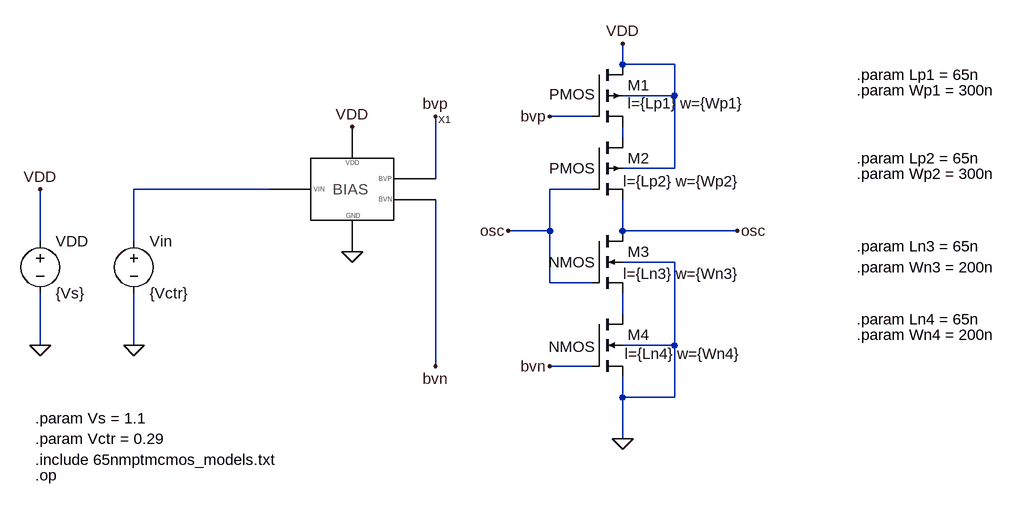
[diagram p0: schematic Est.asc]
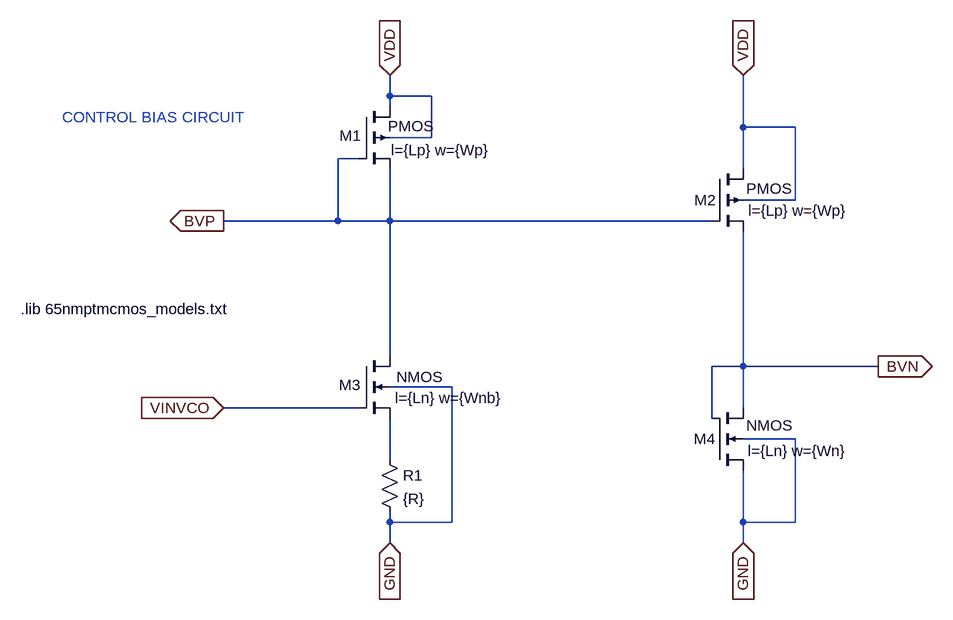
[diagram p1: sub-circuit bias.asc]
Est.asc, the LTspice schematic file:
Version 4
SHEET 1 1880 680
WIRE 816 -112 816 -144
WIRE 896 -112 816 -112
WIRE 896 -64 896 -112
WIRE 896 -64 816 -64
WIRE 768 -32 704 -32
WIRE 816 0 816 -16
WIRE 896 48 896 -64
WIRE 896 48 816 48
WIRE 528 64 528 -32
WIRE 272 80 64 80
WIRE 768 80 704 80
WIRE 704 144 704 80
WIRE 704 144 640 144
WIRE 816 144 816 96
WIRE 992 144 816 144
WIRE -80 160 -80 80
WIRE 64 160 64 80
WIRE 896 192 816 192
WIRE 704 224 704 144
WIRE 768 224 704 224
WIRE 816 272 816 240
WIRE -80 320 -80 240
WIRE 64 320 64 240
WIRE 896 320 896 192
WIRE 896 320 816 320
WIRE 528 352 528 96
WIRE 768 352 704 352
WIRE 816 400 816 368
WIRE 896 400 896 320
WIRE 896 400 816 400
WIRE 816 464 816 400
FLAG -80 320 0
FLAG 64 320 0
FLAG 816 464 0
FLAG 400 176 0
FLAG -80 80 VDD
FLAG 400 -16 VDD
FLAG 816 -144 VDD
FLAG 640 144 osc
FLAG 528 -32 bvp
FLAG 704 -32 bvp
FLAG 528 352 bvn
FLAG 704 352 bvn
FLAG 992 144 osc
SYMBOL Bias 400 80 R0
SYMATTR InstName X1
SYMBOL pmos4 768 -112 R0
WINDOW 3 -65 46 Left 2
WINDOW 123 56 60 Left 2
SYMATTR Value2 l={Lp1} w={Wp1}
SYMATTR InstName M1
SYMBOL pmos4 768 0 R0
WINDOW 3 -65 48 Left 2
WINDOW 123 49 68 Left 2
SYMATTR Value2 l={Lp2} w={Wp2}
SYMATTR InstName M2
SYMBOL nmos4 768 144 R0
WINDOW 3 -66 48 Left 2
WINDOW 123 49 66 Left 2
SYMATTR Value2 l={Ln3} w={Wn3}
SYMATTR InstName M3
SYMBOL nmos4 768 272 R0
WINDOW 3 -66 50 Left 2
WINDOW 123 51 61 Left 2
SYMATTR Value2 l={Ln4} w={Wn4}
SYMATTR InstName M4
SYMBOL voltage -80 144 R0
SYMATTR InstName VDD
SYMATTR Value {Vs}
SYMBOL voltage 64 144 R0
SYMATTR InstName Vin
SYMATTR Value {Vctr}
TEXT -88 432 Left 2 !.param Vs = 1.1
TEXT -88 464 Left 2 !.param Vctr = 0.29
TEXT -88 496 Left 2 !.include 65nmptmcmos_models.txt
TEXT -88 520 Left 2 !.op
TEXT 1176 -96 Left 2 !.param Lp1 = 65n
TEXT 1176 -72 Left 2 !.param Wp1 = 300n
TEXT 1176 32 Left 2 !.param Lp2 = 65n
TEXT 1176 56 Left 2 !.param Wp2 = 300n
TEXT 1176 168 Left 2 !.param Ln3 = 65n
TEXT 1176 200 Left 2 !.param Wn3 = 200n
TEXT 1176 280 Left 2 !.param Ln4 = 65n
TEXT 1176 304 Left 2 !.param Wn4 = 200n

bias.asc, the sub-circuit schematic file:
Version 4
SHEET 1 1292 832
WIRE 80 32 80 0
WIRE 144 32 80 32
WIRE 80 48 80 32
WIRE 624 80 624 0
WIRE 704 80 624 80
WIRE 144 96 144 32
WIRE 144 96 80 96
WIRE 32 128 0 128
WIRE 624 144 624 80
WIRE 704 192 704 80
WIRE 704 192 624 192
WIRE 0 224 0 128
WIRE 0 224 -176 224
WIRE 80 224 80 144
WIRE 80 224 0 224
WIRE 576 224 80 224
WIRE 80 432 80 224
WIRE 624 448 624 240
WIRE 624 448 576 448
WIRE 832 448 624 448
WIRE 176 480 80 480
WIRE 32 512 -176 512
WIRE 624 512 624 448
WIRE 576 528 576 448
WIRE 704 560 624 560
WIRE 80 592 80 528
WIRE 80 688 80 672
WIRE 176 688 176 480
WIRE 176 688 80 688
WIRE 624 688 624 608
WIRE 704 688 704 560
WIRE 704 688 624 688
WIRE 80 720 80 688
WIRE 624 720 624 688
FLAG 832 448 BVN
IOPIN 832 448 Out
FLAG 80 0 VDD
IOPIN 80 0 In
FLAG 624 0 VDD
IOPIN 624 0 In
FLAG -176 224 BVP
IOPIN -176 224 Out
FLAG 80 720 GND
IOPIN 80 720 In
FLAG 624 720 GND
IOPIN 624 720 In
FLAG -176 512 VINVCO
IOPIN -176 512 In
SYMBOL res 64 576 R0
SYMATTR InstName R1
SYMATTR Value {R}
SYMBOL pmos4 32 48 R0
WINDOW 123 50 67 Left 2
WINDOW 0 -29 45 Left 2
WINDOW 3 45 30 Left 2
SYMATTR Value2 l={Lp} w={Wp}
SYMATTR InstName M1
SYMBOL pmos4 576 144 R0
WINDOW 123 56 64 Left 2
WINDOW 0 -27 48 Left 2
WINDOW 3 53 30 Left 2
SYMATTR Value2 l={Lp} w={Wp}
SYMATTR InstName M2
SYMBOL nmos4 32 432 R0
WINDOW 123 56 65 Left 2
WINDOW 0 -30 45 Left 2
WINDOW 3 58 32 Left 2
SYMATTR Value2 l={Ln} w={Wnb}
SYMATTR InstName M3
SYMBOL nmos4 576 608 M180
WINDOW 123 55 30 Left 2
WINDOW 0 -28 48 Left 2
WINDOW 3 53 69 Left 2
SYMATTR Value2 l={Ln} w={Wn}
SYMATTR InstName M4
TEXT -488 360 Left 2 !.lib 65nmptmcmos_models.txt
TEXT -424 64 Left 2 ;CONTROL BIAS CIRCUIT

The netlist it stands for:
* Est.asc
XX1 VDD 0 bvp bvn N002 bias
M1 VDD bvp N001 VDD PMOS l={Lp1} w={Wp1}
M2 N001 osc osc VDD PMOS l={Lp2} w={Wp2}
M3 osc osc N003 0 NMOS l={Ln3} w={Wn3}
M4 N003 bvn 0 0 NMOS l={Ln4} w={Wn4}
VDD VDD 0 {Vs}
Vin N002 0 {Vctr}

* block symbol definitions
.subckt bias VDD GND BVP BVN VINVCO
R1 N001 GND {R}
M1 VDD BVP BVP VDD PMOS l={Lp} w={Wp}
M2 VDD BVP BVN VDD PMOS l={Lp} w={Wp}
M3 BVP VINVCO N001 GND NMOS l={Ln} w={Wnb}
M4 GND BVN BVN GND NMOS l={Ln} w={Wn}
.lib 65nmptmcmos_models.txt
* CONTROL BIAS CIRCUIT
.ends bias

.model NMOS NMOS
.model PMOS PMOS
.lib standard.mos
.param Vs = 1.1
.param Vctr = 0.29
.include 65nmptmcmos_models.txt
.op
.param Lp1 = 65n
.param Wp1 = 300n
.param Lp2 = 65n
.param Wp2 = 300n
.param Ln3 = 65n
.param Wn3 = 200n
.param Ln4 = 65n
.param Wn4 = 200n
.backanno
.end